# Altium schematic sheet Sheet3.SchDoc
size A
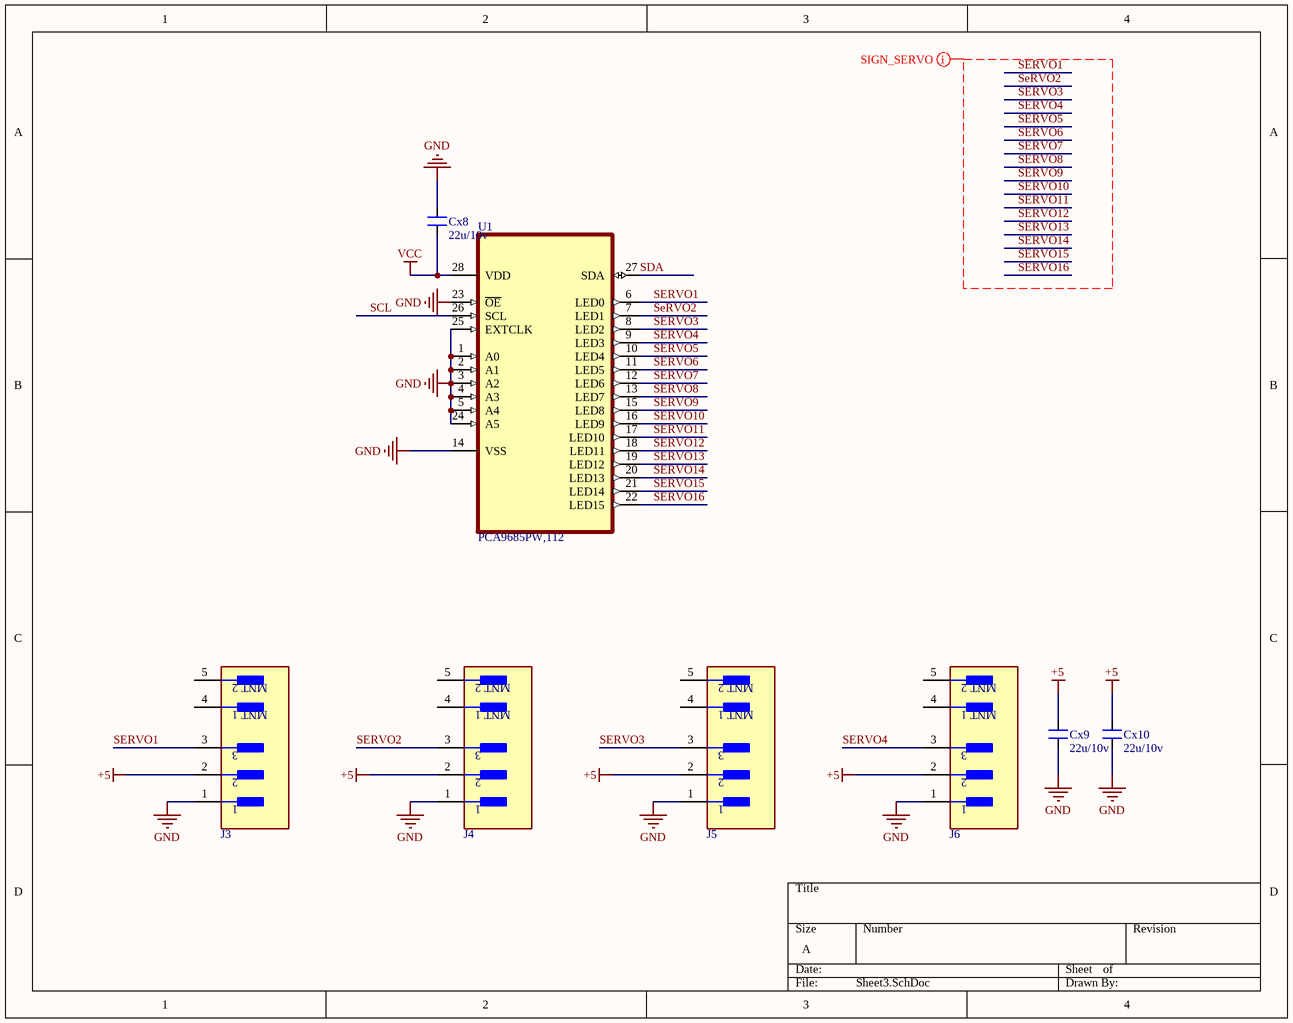
[diagram p0: Sheet3.SchDoc]

## Parts
Cx8  22u/10v  [CN-SMD-1206]
Cx9  22u/10v  [CN-SMD-1206]
Cx10  22u/10v  [CN-SMD-1206]
J3  53261-0371  [Molex_0_MFG]  (value not drawn)
J4  53261-0371  [Molex_0_MFG]  (value not drawn)
J5  53261-0371  [Molex_0_MFG]  (value not drawn)
J6  53261-0371  [Molex_0_MFG]  (value not drawn)
U1  PCA9685PW,112  [SOP65P640X110-28N]

## Nets
+5: Cx9.2 Cx10.2 J3.2 J4.2 J5.2 J6.2
GND: Cx8.2 Cx9.1 Cx10.1 J3.1 J4.1 J5.1 J6.1 U1.1(A0) U1.2(A1) U1.3(A2) U1.4(A3) U1.5(A4) U1.14(VSS) U1.23(~{OE}) U1.24(A5) U1.25(EXTCLK)
VCC: Cx8.1 U1.28(VDD)
SCL: U1.26(SCL)
SDA: U1.27(SDA)
SERVO1: J3.3 U1.6(LED0)
SeRVO2: J4.3 U1.7(LED1)
SERVO3: J5.3 U1.8(LED2)
SERVO4: J6.3 U1.9(LED3)
SERVO5: U1.10(LED4)
SERVO6: U1.11(LED5)
SERVO7: U1.12(LED6)
SERVO8: U1.13(LED7)
SERVO9: U1.15(LED8)
SERVO10: U1.16(LED9)
SERVO11: U1.17(LED10)
SERVO12: U1.18(LED11)
SERVO13: U1.19(LED12)
SERVO14: U1.20(LED13)
SERVO15: U1.21(LED14)
SERVO16: U1.22(LED15)

Not connected (* = marked no-connect by the designer): J3 4(MNT_1) 5(MNT_2); J4 4(MNT_1) 5(MNT_2); J5 4(MNT_1) 5(MNT_2); J6 4(MNT_1) 5(MNT_2)

## Layout directives
net class SIGN_SERVO: SERVO1, SeRVO2, SERVO3, SERVO4, SERVO5, SERVO6, SERVO7, SERVO8, SERVO9, SERVO10, SERVO11, SERVO12, SERVO13, SERVO14, SERVO15, SERVO16

## Library data of the parts
Cx8-Cx10 = CN: Value: 33pF
U1 = PCA9685PW,112: LED Driver IC 16 Output Linear PWM Dimming 25mA 28-TSSOP; MF: NXP USA; Purchase-URL: https://pricing.snapeda.com/search/part/PCA9685PW,112/?ref=eda; Value: *; Package: TSSOP-28 NXP Semiconductors; Digi-Key_Part_Number: 568-8366-5-ND; SnapEDA_Link: https://www.snapeda.com/parts/PCA9685PW,112/NXP%20USA%20Inc./view-part/550390/?ref=snap; MP: PCA9685PW,112; Check_prices: https://www.snapeda.com/parts/PCA9685PW,112/NXP%20USA%20Inc./view-part/550390/?ref=eda